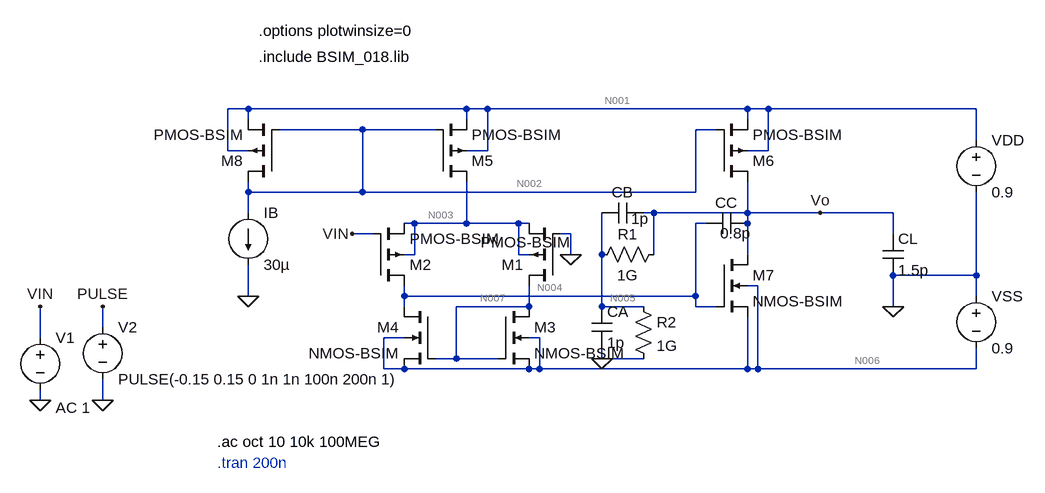
[diagram p0: schematic Draft1.asc]
Draft1.asc, the LTspice schematic file:
Version 4.1
SHEET 1 1228 680
WIRE 0 -80 -32 -80
WIRE 336 -80 0 -80
WIRE 368 -80 336 -80
WIRE 768 -80 368 -80
WIRE 800 -80 768 -80
WIRE 1120 -80 800 -80
WIRE 0 -64 0 -80
WIRE 336 -64 336 -80
WIRE 768 -64 768 -80
WIRE 176 -48 48 -48
WIRE 288 -48 176 -48
WIRE 720 -48 688 -48
WIRE 1120 -32 1120 -80
WIRE -32 -16 -32 -80
WIRE 0 -16 -32 -16
WIRE 368 -16 368 -80
WIRE 368 -16 336 -16
WIRE 800 -16 800 -80
WIRE 800 -16 768 -16
WIRE 0 48 0 32
WIRE 176 48 176 -48
WIRE 176 48 0 48
WIRE 688 48 688 -48
WIRE 688 48 176 48
WIRE 0 80 0 48
WIRE 624 80 608 80
WIRE 768 80 768 32
WIRE 768 80 624 80
WIRE 880 80 768 80
WIRE 992 80 880 80
WIRE 256 96 240 96
WIRE 336 96 336 32
WIRE 336 96 256 96
WIRE 416 96 336 96
WIRE 432 96 416 96
WIRE 704 96 688 96
WIRE 768 96 768 80
WIRE 192 112 160 112
WIRE 496 112 480 112
WIRE 992 112 992 80
WIRE 256 144 256 96
WIRE 256 144 240 144
WIRE 416 144 416 96
WIRE 432 144 416 144
WIRE 496 144 496 112
WIRE 544 144 544 80
WIRE 624 144 624 80
WIRE 768 144 768 96
WIRE 1120 176 1120 48
WIRE 1120 176 992 176
WIRE 784 192 768 192
WIRE 0 208 0 160
WIRE 240 208 240 192
WIRE 688 208 688 96
WIRE 688 208 240 208
WIRE 1120 208 1120 176
WIRE 240 224 240 208
WIRE 432 224 432 192
WIRE 432 224 320 224
WIRE 544 224 544 144
WIRE 608 224 544 224
WIRE 688 224 688 208
WIRE 720 224 688 224
WIRE 992 224 992 176
WIRE -224 256 -224 224
WIRE -320 272 -320 224
WIRE 240 272 208 272
WIRE 448 272 432 272
WIRE 320 304 320 224
WIRE 320 304 288 304
WIRE 384 304 320 304
WIRE 544 304 544 288
WIRE 608 304 544 304
WIRE 208 320 208 272
WIRE 240 320 208 320
WIRE 432 320 240 320
WIRE 448 320 448 272
WIRE 448 320 432 320
WIRE 768 320 768 240
WIRE 768 320 448 320
WIRE 784 320 784 192
WIRE 784 320 768 320
WIRE 1120 320 1120 288
WIRE 1120 320 784 320
WIRE -320 368 -320 352
WIRE -224 368 -224 336
FLAG 0 208 0
FLAG 544 304 0
FLAG 992 224 0
FLAG -320 368 0
FLAG 880 80 Vo
FLAG -224 368 0
FLAG -224 224 PULSE
FLAG -320 224 VIN
FLAG 496 144 0
FLAG 160 112 VIN
SYMBOL pmos4 480 192 R180
WINDOW 3 -15 67 Left 2
SYMATTR Value PMOS-BSIM
SYMATTR InstName M1
SYMATTR Value2 l=1u w=11.4u ad=32e-12 as=32e-12 pd=65u ps=65u
SYMBOL pmos4 192 192 M180
SYMATTR InstName M2
SYMATTR Value PMOS-BSIM
SYMATTR Value2 l=1u w=11.4u ad=32e-12 as=32e-12 pd=65u ps=65u
SYMBOL pmos4 48 32 R180
SYMATTR InstName M8
SYMATTR Value PMOS-BSIM
SYMATTR Value2 l=1u w=14.29u ad=10e-12 as=10e-12 pd=21u ps=21u
SYMBOL pmos4 288 32 M180
SYMATTR InstName M5
SYMATTR Value PMOS-BSIM
SYMATTR Value2 l=1u w=28.6u ad=60e-12 as=50e-12 pd=121u ps=121u
SYMBOL pmos4 720 32 M180
SYMATTR InstName M6
SYMATTR Value PMOS-BSIM
SYMATTR Value2 l=1u w=57.14u ad=75e-12 as=75e-12 pd=151u ps=151u
SYMBOL nmos4 288 224 M0
SYMATTR InstName M4
SYMATTR Value NMOS-BSIM
SYMATTR Value2 l=1u w=8.5u ad=5e-12 as=5e-12 pd=12u ps=12u
SYMBOL nmos4 384 224 R0
SYMATTR InstName M3
SYMATTR Value NMOS-BSIM
SYMATTR Value2 l=1u w=8.5u ad=5e-12 as=5e-12 pd=12u ps=12u
SYMBOL nmos4 720 144 R0
SYMATTR InstName M7
SYMATTR Value NMOS-BSIM
SYMATTR Value2 l=1u w=34u ad=13e-12 as=13e-12 pd=27u ps=27u
SYMBOL current 0 80 R0
WINDOW 123 0 0 Left 0
WINDOW 39 0 0 Left 0
SYMATTR InstName IB
SYMATTR Value 30µ
SYMBOL voltage -320 256 R0
WINDOW 123 24 124 Left 2
WINDOW 39 0 0 Left 0
SYMATTR Value2 AC 1
SYMATTR InstName V1
SYMATTR Value ""
SYMBOL cap 608 64 R90
WINDOW 0 0 32 VBottom 2
WINDOW 3 9 5 VTop 2
SYMATTR InstName CB
SYMATTR Value 1p
SYMBOL cap 528 224 R0
SYMATTR InstName CA
SYMATTR Value 1p
SYMBOL cap 768 80 R90
WINDOW 0 0 32 VBottom 2
WINDOW 3 16 18 VTop 2
SYMATTR InstName CC
SYMATTR Value 0.8p
SYMBOL cap 976 112 R0
SYMATTR InstName CL
SYMATTR Value 1.5p
SYMBOL voltage 1120 192 R0
SYMATTR InstName VSS
SYMATTR Value 0.9
SYMBOL voltage 1120 -48 R0
SYMATTR InstName VDD
SYMATTR Value 0.9
SYMBOL res 640 128 R90
WINDOW 0 0 56 VBottom 2
WINDOW 3 32 56 VTop 2
SYMATTR InstName R1
SYMATTR Value 1G
SYMBOL res 592 208 R0
SYMATTR InstName R2
SYMATTR Value 1G
SYMBOL voltage -224 240 R0
WINDOW 123 0 0 Left 0
WINDOW 39 0 0 Left 0
SYMATTR InstName V2
SYMATTR Value PULSE(-0.15 0.15 0 1n 1n 100n 200n 1)
TEXT 16 -200 Left 2 !.options plotwinsize=0
TEXT 16 -160 Left 2 !.include BSIM_018.lib
TEXT -48 432 Left 2 !.ac oct 10 10k 100MEG
TEXT -48 464 Left 2 ;.tran 200n

The netlist it stands for:
* Draft1.asc
M1 N007 0 N003 N003 PMOS-BSIM l=1u w=11.4u ad=32e-12 as=32e-12 pd=65u ps=65u
M2 N004 VIN N003 N003 PMOS-BSIM l=1u w=11.4u ad=32e-12 as=32e-12 pd=65u ps=65u
M8 N002 N002 N001 N001 PMOS-BSIM l=1u w=14.29u ad=10e-12 as=10e-12 pd=21u ps=21u
M5 N003 N002 N001 N001 PMOS-BSIM l=1u w=28.6u ad=60e-12 as=50e-12 pd=121u ps=121u
M6 Vo N002 N001 N001 PMOS-BSIM l=1u w=57.14u ad=75e-12 as=75e-12 pd=151u ps=151u
M4 N004 N007 N006 N006 NMOS-BSIM l=1u w=8.5u ad=5e-12 as=5e-12 pd=12u ps=12u
M3 N007 N007 N006 N006 NMOS-BSIM l=1u w=8.5u ad=5e-12 as=5e-12 pd=12u ps=12u
M7 Vo N004 N006 N006 NMOS-BSIM l=1u w=34u ad=13e-12 as=13e-12 pd=27u ps=27u
IB N002 0 30µ
V1 VIN 0 AC 1
CB Vo N005 1p
CA N005 0 1p
CC Vo N004 0.8p
CL Vo 0 1.5p
VSS 0 N006 0.9
VDD N001 0 0.9
R1 Vo N005 1G
R2 N005 0 1G
V2 PULSE 0 PULSE(-0.15 0.15 0 1n 1n 100n 200n 1)
.model NMOS NMOS
.model PMOS PMOS
.lib standard.mos
.options plotwinsize=0
.include BSIM_018.lib
.ac oct 10 10k 100MEG
* .tran 200n
.backanno
.end

* Results of the author's LTspice run, read from the files saved beside the schematic
* Operating Point, zero values left out:
*   V(n003) = 735.2 mV
*   V(n002) = 166.6 mV
*   V(vo) = 644.1 mV
*   V(pulse) = -150 mV
*   V(n007) = -328.1 mV
*   V(n004) = -328.1 mV
*   V(n001) = 900 mV
*   V(n006) = -900 mV
*   V(n005) = 322.1 mV
*   Id(M1) = -25.19 µA
*   Is(M1) = 25.19 µA
*   Ib(M1) = 1.063 pA
*   Id(M6) = -111.3 µA
*   Is(M6) = 111.3 µA
*   Id(M4) = 25.19 µA
*   Is(M4) = -25.19 µA
*   Id(M7) = 111.3 µA
*   Is(M7) = -111.3 µA
*   Ib(M7) = -1.544 pA
*   I(VDD) = -191.6 µA
*   Id(M8) = -30 µA
*   Is(M8) = 30 µA
*   Id(M5) = -50.38 µA
*   Is(M5) = 50.38 µA
*   I(IB) = 30 µA
*   I(R2) = 322.1 pA
*   Id(M2) = -25.19 µA
*   Is(M2) = 25.19 µA
*   Ib(M2) = 1.063 pA
*   Id(M3) = 25.19 µA
*   Is(M3) = -25.19 µA
*   I(VSS) = -161.6 µA
*   I(R1) = 322.1 pA
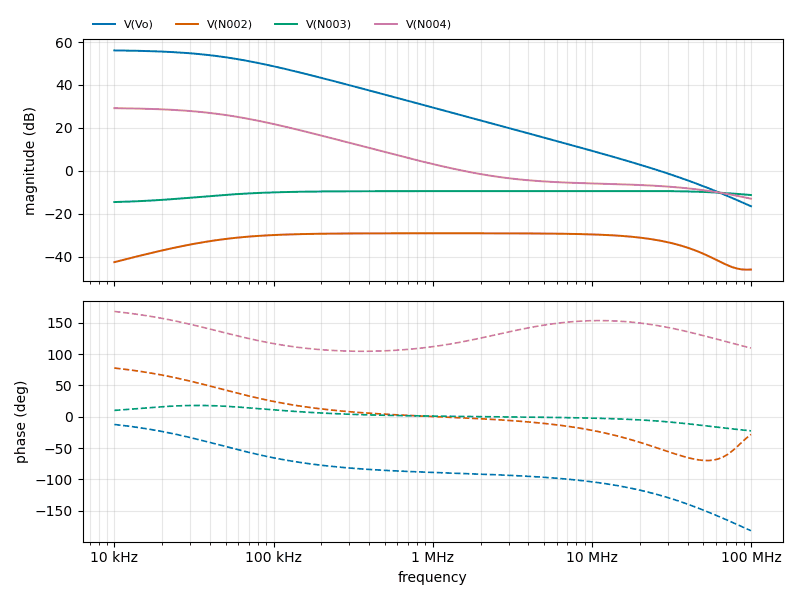
[diagram p1: AC Analysis of Draft1.asc, plotted from the saved traces]
* AC Analysis, 1 run:
*   V(Vo): 56.09 dB at 10 kHz, -16.43 dB at 100 MHz, peak 56.09 dB at 10 kHz, 3 dB below the peak at 48.09 kHz
*   V(N002): -42.45 dB at 10 kHz, -45.87 dB at 100 MHz, peak -29.01 dB at 1.114 MHz, 3 dB below the peak at 45.84 kHz and 24.94 MHz
*   V(N003): -14.48 dB at 10 kHz, -11.21 dB at 100 MHz, peak -9.34 dB at 19.11 MHz, 3 dB below the peak at 31.35 kHz
*   V(N004): 29.21 dB at 10 kHz, -12.92 dB at 100 MHz, peak 29.21 dB at 10 kHz, 3 dB below the peak at 48.1 kHz